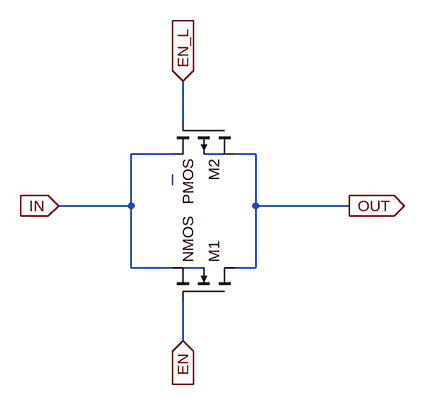
[diagram p0: schematic tg.asc]
tg.asc, the LTspice schematic file:
Version 4
SHEET 1 880 680
WIRE 96 80 96 16
WIRE 80 128 16 128
WIRE 160 128 128 128
WIRE 208 128 176 128
WIRE 80 176 80 160
WIRE -48 208 -96 208
WIRE -16 208 -48 208
WIRE 16 208 16 128
WIRE 16 208 -16 208
WIRE 208 208 208 128
WIRE 272 208 208 208
WIRE 320 208 272 208
WIRE 352 208 320 208
WIRE 16 304 16 208
WIRE 80 304 16 304
WIRE 128 304 96 304
WIRE 208 304 208 208
WIRE 208 304 176 304
WIRE 96 416 96 352
FLAG -96 208 IN
IOPIN -96 208 In
FLAG 96 16 EN_L
IOPIN 96 16 In
FLAG 96 416 EN
IOPIN 96 416 In
FLAG 352 208 OUT
IOPIN 352 208 Out
DATAFLAG -48 208 ""
DATAFLAG 272 208 ""
DATAFLAG -16 208 ""
DATAFLAG -48 208 ""
DATAFLAG 320 208 ""
DATAFLAG 80 160 ""
DATAFLAG 80 176 ""
SYMBOL nmos4 176 352 M270
SYMATTR InstName M1
SYMATTR Value2 l=90n w=200n
SYMBOL pmos4 176 80 R90
SYMATTR InstName M2
SYMATTR Value2 l=90n w=400n

The netlist it stands for:
* tg.asc
M1 OUT EN IN N003 NMOS l=90n w=200n
M2 OUT EN_L IN N001 PMOS l=90n w=400n
.model NMOS NMOS
.model PMOS PMOS
.lib standard.mos
.backanno
.end